# Altium schematic sheet User_LEDs.SchDoc
size A; Organization: Altium Limited; Address1: L3, 12a Rodborough Rd; Address2: Frenchs Forest; Address3: NSW; Address4: Australia 2086
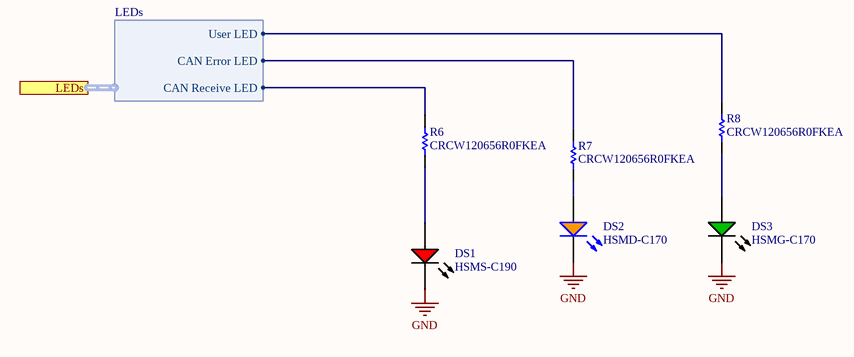
[diagram p0: User_LEDs.SchDoc]

## Parts
DS1  HSMS-C190  [AVAG-HSMX-C190_V]
DS2  HSMD-C170  [AVAG-HSMX-C170_V]
DS3  HSMG-C170  [AVAG-HSMX-C170_V]
R6  CRCW120656R0FKEA  [RESC3216X60X45LL10T20]
R7  CRCW120656R0FKEA  [RESC3216X60X45LL10T20]
R8  CRCW120656R0FKEA  [RESC3216X60X45LL10T20]

## Ports
LEDs (harness LEDs)

## Harnesses
LEDs: CAN Error LED, CAN Receive LED, User LED

## Nets
GND: DS1.2(K) DS2.2(K) DS3.2(K)
NetDS1_1: DS1.1(A) R6.1
NetDS2_1: DS2.1(A) R7.1
NetDS3_1: DS3.1(A) R8.1
NetR6_2: R6.2 ; port LEDs.CAN Receive LED
NetR7_2: R7.2 ; port LEDs.CAN Error LED
NetR8_2: R8.2 ; port LEDs.User LED

## Notes on the sheet
- Title
- Size:
- Date:
- A
- Number:
- Time:
- Revision:
- Sheet
- of
- File:

## Library data of the parts
DS1 = CMP-2000-06427-1: LED Uni-Color Red, 52 mW, 20 mA, -40 to 85 degC, 2-Pin SMD, RoHS, Tape and Reel; Manufacturer: Avago; Reverse Voltage: 5V; Viewing Angle: 170deg; High Brightness: No; Lens Type: ColorlessDiffused; DELETED: Compliant; Product Height (mm): 0.8mm; Dominant Wave Length: 626nm; Number of  Elements: 1; Chip Material: GaP; Lum Intensity: 10mcd; Product Length (mm): 1.6mm; Forward Voltage: 2.6V; Power Dissipation: 52W; Shape Type: Rectangular; Forward Current: 25mA; Peak Wavelength: 630nm; Test Current (It): 20mA; Main Category: ChipLED; Lens Dimensions: 1x0.8x0.5mm; Pin Count: 2; Package Reference: HSMX-C190; Mounting Technology: SurfaceMount; Mounting: SurfaceMount; Datasheet URL: http://docs.avagotech.com/docs/AV02-0551EN; Package Type: ChipLed; Operating Temperature Classification: Industrial; Datasheet Version: 03/2012; Operating Temp Range: -40Cto85C; Emitting Color: Red; Rad Hardened: No; Manufacturer URL: http://www.avagotech.com/; Luminous Intensity: 10mcd; Package Description: 2-Pin Surface Mount Device, Body 1.6 x 0.8 mm, Height 0.9 mm; Type: Uni-Color; Packaging: TapeandReel; Product Depth (mm): 0.8mm
DS2 = CMP-2000-06421-1: LED Uni-Color Orange, 52 mW, 20 mA, -40 to 85 degC, 2-Pin SMD, RoHS, Tape and Reel; Manufacturer: Avago; Forward Current If Max: 20mA; External Length / Height: 2mm; Luminous Intensity: 8mcd; Lens Shape: Rectangular; Bulb Size: 1.25mmx1.4mm; External Width: 1.25mm; Wavelength Typ: 605nm; Dominant Wavelength: 604nm; PIV Max: 5V; Opto Mounting Orientation: Top; Viewing Angle: 170°; LED Type: Standard; Forward Voltage: 2.2V; SVHC: NoSVHC(19-Dec-2012); No. of Pins: 2; External Depth: 0.8mm; Power Dissipation Pd: 52mW; Storage Temperature Max: 85°C; Package Description: 2-Pin Surface Mount Device, Body 2 x 1.25 mm, Height 0.8 mm; MSL: MSL2A-4weeks; Operating Temperature Range: -30°Cto+85°C; Datasheet URL: http://docs.avagotech.com/docs/AV02-0551EN; Manufacturer URL: http://www.avagotech.com/; Operating Temperature Min: -30°C; Light Area Height: 1.25mm; Mounting Technology: SurfaceMount; Storage Temperature Min: -40°C; LED Mounting: SMD; Peak Wavelength: 605nm; Package / Case: SMD; Peak Forward Current: 20mA; Forward Voltage VF Max: 2.2V; Mounting Type: SMD; LED Colour: Orange; Forward Current If: 20mA; Operating Temperature Max: 85°C; Voltage Vf Typ: 2.2V; Package Reference: HSMX-C170; Datasheet Version: 03/2012; Opto Case Style: SMD; Luminous Intensity Typ: 8mcd
DS3 = CMP-2000-05062-1: Chip LED, Green, 2.2 V, -40 to 85 degC, 2-Pin SMD, Pb-Free, Tape and Reel; Manufacturer: Avago; No. of Pins: 2; Peak Wavelength: 570nm; SVHC: NoSVHC(16-Jun-2014); Dominant Wavelength: 572nm; Forward Current If: 20mA; Viewing Angle: 170deg; Lens Shape: Rectangular; PIV Max: 5V; External Width: 1.25mm; LED Type: Standard; External Depth: 0.8mm; Opto Mounting Orientation: Top; Luminous Intensity: 15mcd; Luminous Intensity Min: 4mcd; Forward Voltage VF Max: 2.6V; External Length / Height: 2mm; Bulb Size: 1.25mmx1.4mm; Light Area Height: 1mm; Voltage Vf Typ: 2.2V; Operating Temperature Max: 85degC; Datasheet Version: Oct-08; MSL: MSL2A-4weeks; Peak Forward Current: 20mA; Package Description: 2-Pin Surface Mount Device, Body 2 x 1.25 mm, Height 0.8 mm; Datasheet URL: https://datasheet.ciiva.com/29280/180495-da-01-en-chip-led-hsmg-c170-gelb-gruen-29280971.pdf; Storage Temperature Min: -40degC; LED Colour: Green; Wavelength Typ: 570nm; Mounting Type: SMD; Forward Current If Max: 20mA; Dominant Wavelength Typ: 572nm; LED Mounting: SMD; Operating Temperature Range: -30degCto+85degC; Operating Temperature Min: -30degC; Manufacturer URL: http://www.avagotech.com/; Packaging: CutTape; Luminous Intensity Typ: 15mcd; Package Reference: HSMX-C170; Storage Temperature Max: 85degC; Opto Case Style: SMD; Forward Voltage: 2.2V
R6-R8 = CMP-2003-02285-1: Manufacturer: Vishay Dale; Part Number: CRCW120656R0FKEA